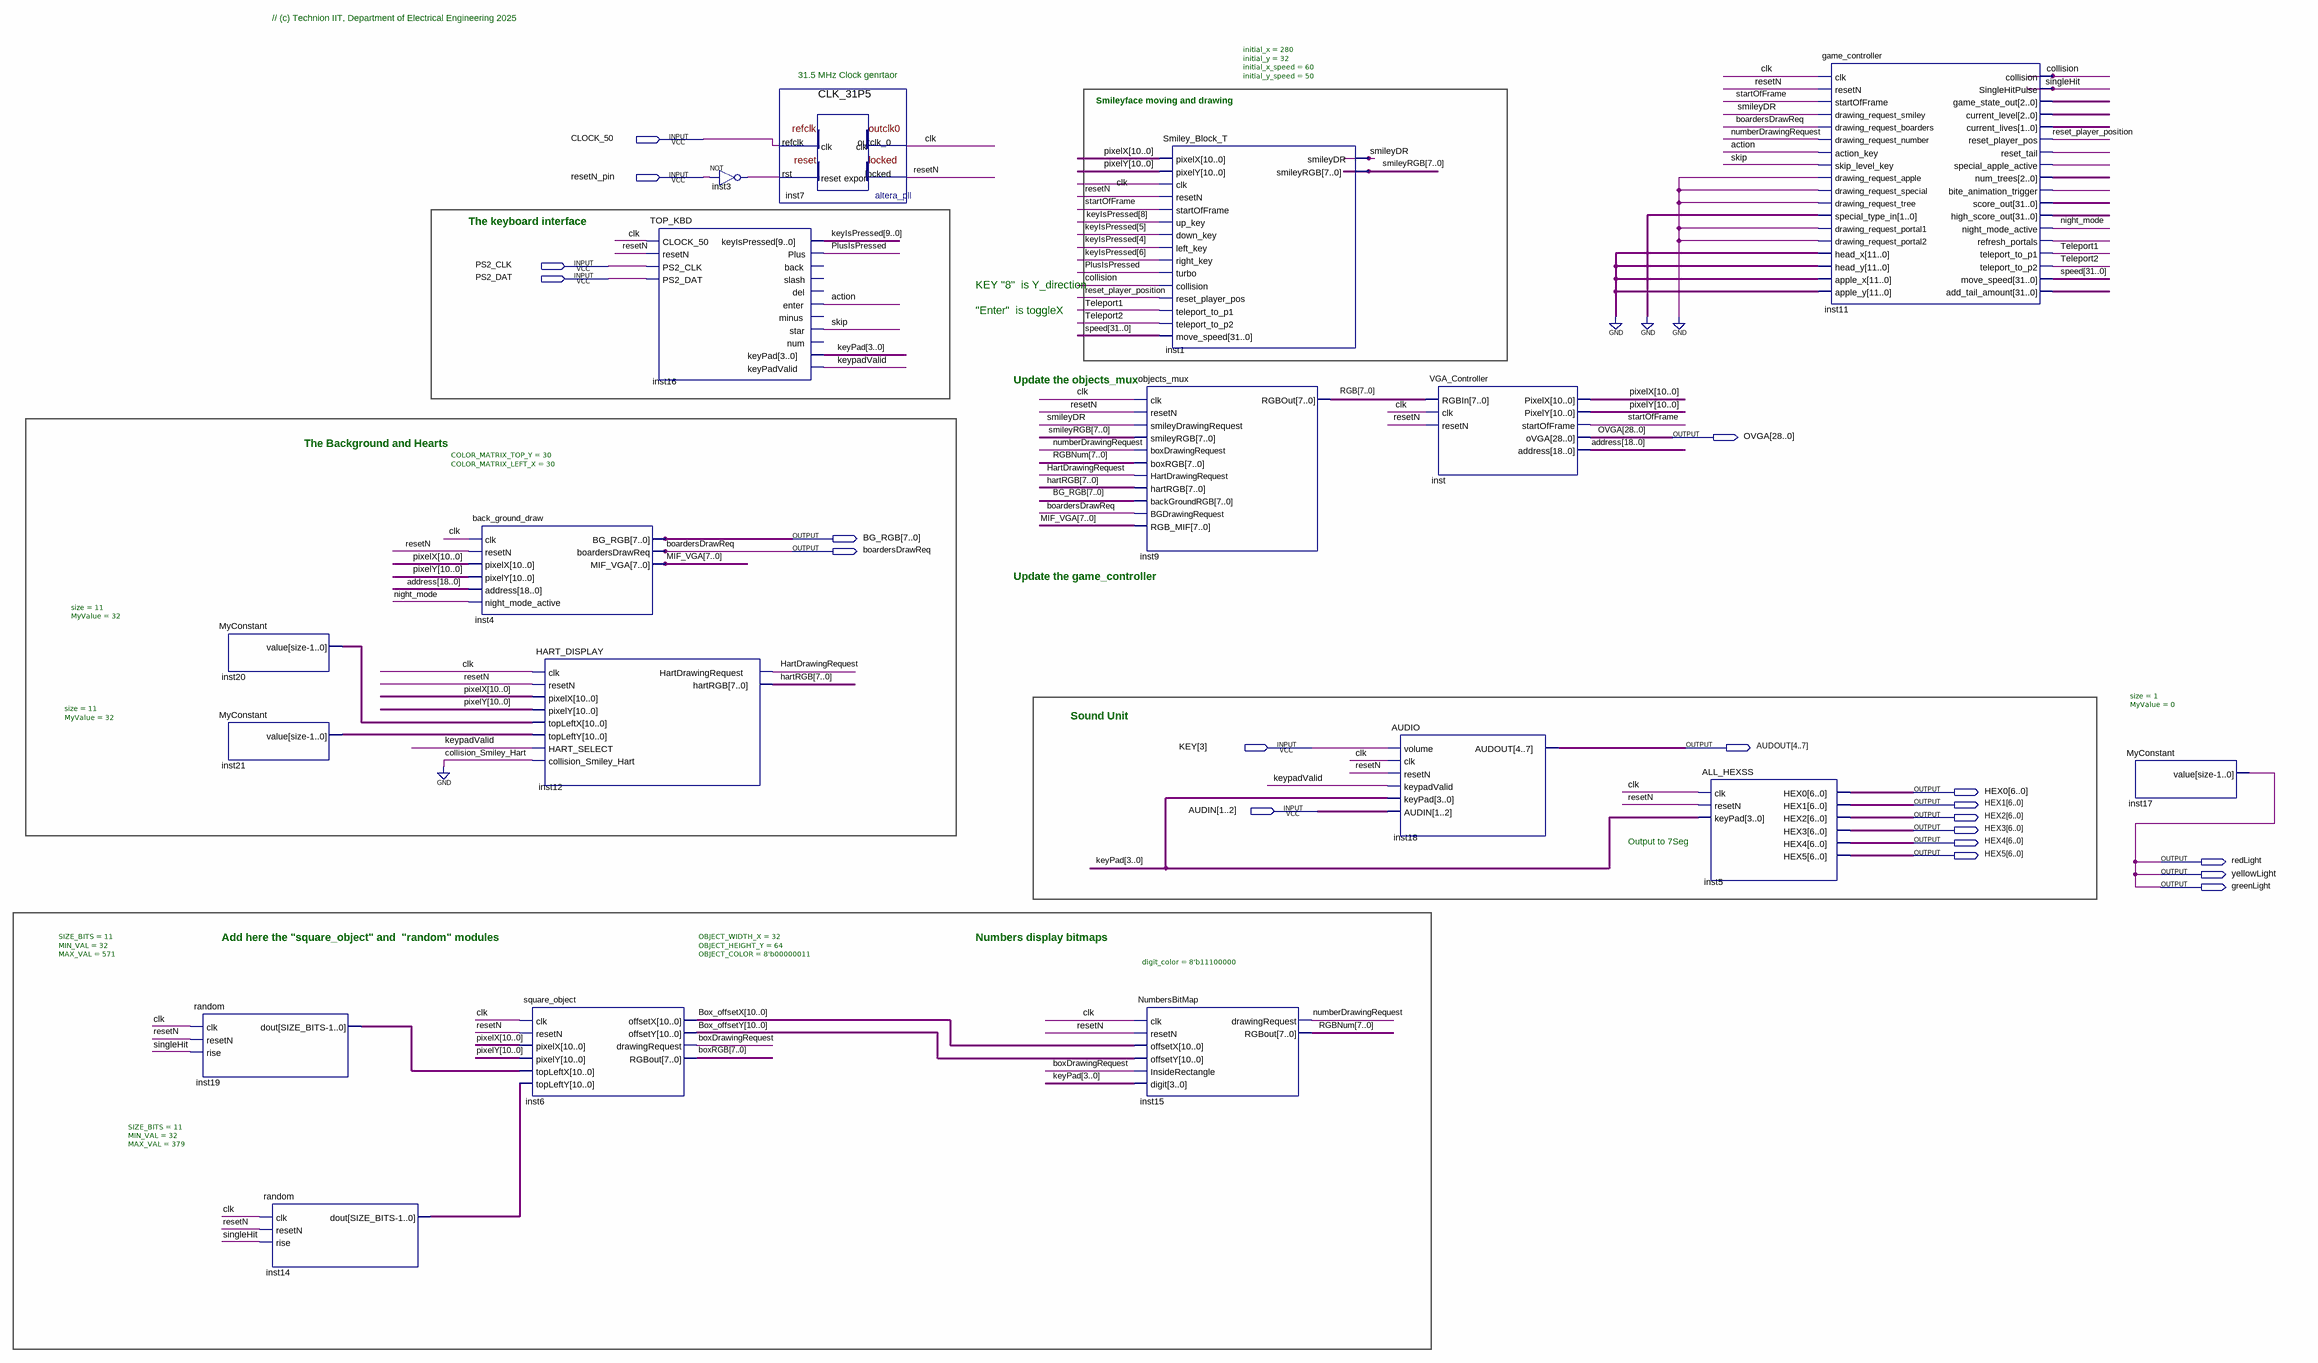
[diagram p0: schematic sheet]
// Quartus schematic TOP_VGA_DEMO.bdf as structural Verilog: 18 symbols, 19 pins
module TOP_VGA_DEMO (
  input  CLOCK_50,
  input  resetN_pin,
  input  PS2_CLK,
  input  PS2_DAT,
  input  [3:3] KEY,
  input  [1:2] AUDIN,
  output [28:0] OVGA,
  output [7:0] BG_RGB,
  output boardersDrawReq,
  output [4:7] AUDOUT,
  output [6:0] HEX0,
  output [6:0] HEX1,
  output [6:0] HEX2,
  output [6:0] HEX3,
  output [6:0] HEX4,
  output [6:0] HEX5,
  output redLight,
  output yellowLight,
  output greenLight
);

  wire action, boxDrawingRequest, clk, collision, HartDrawingRequest, inst3_out,
       inst11_bite_animation_trigger, inst11_refresh_portals, inst11_reset_tail, inst11_special_apple_active,
       keypadValid, night_mode, numberDrawingRequest, PlusIsPressed, reset_player_position, resetN,
       singleHit, skip, smileyDR, startOfFrame, Teleport1, Teleport2;
  wire [1:0] inst11_current_lives;
  wire [2:0] inst11_current_level, inst11_game_state_out, inst11_num_trees;
  wire [3:0] keyPad;
  wire [7:0] boxRGB, hartRGB, MIF_VGA, RGB, RGBNum, smileyRGB;
  wire [9:0] keyIsPressed;
  wire [10:0] Box_offsetX, Box_offsetY, inst14_dout, inst19_dout, inst20_value, inst21_value, pixelX, pixelY;
  wire [18:0] address;
  wire [31:0] inst11_add_tail_amount, inst11_high_score_out, inst11_score_out, speed;

  MyConstant #(.size(11), .MyValue(32)) inst20 (.value(inst20_value));
  MyConstant #(.size(11), .MyValue(32)) inst21 (.value(inst21_value));
  random #(.SIZE_BITS(11), .MIN_VAL(32), .MAX_VAL(571)) inst19 (
    .clk(clk), .resetN(resetN), .rise(singleHit), .dout(inst19_dout));
  random #(.SIZE_BITS(11), .MIN_VAL(32), .MAX_VAL(379)) inst14 (
    .clk(clk), .resetN(resetN), .rise(singleHit), .dout(inst14_dout));
  back_ground_draw #(.COLOR_MATRIX_TOP_Y(30), .COLOR_MATRIX_LEFT_X(30)) inst4 (
    .clk(clk), .resetN(resetN), .pixelX(pixelX), .pixelY(pixelY), .address(address),
    .night_mode_active(night_mode), .BG_RGB(BG_RGB), .boardersDrawReq(boardersDrawReq), .MIF_VGA(MIF_VGA));
  square_object #(.OBJECT_WIDTH_X(32), .OBJECT_HEIGHT_Y(64), .OBJECT_COLOR(8'b00000011)) inst6 (
    .clk(clk), .resetN(resetN), .pixelX(pixelX), .pixelY(pixelY), .topLeftX(inst19_dout),
    .topLeftY(inst14_dout), .offsetX(Box_offsetX), .offsetY(Box_offsetY), .drawingRequest(boxDrawingRequest),
    .RGBout(boxRGB));
  HART_DISPLAY inst12 (
    .clk(clk), .resetN(resetN), .pixelX(pixelX), .pixelY(pixelY), .topLeftX(inst20_value),
    .topLeftY(inst21_value), .HART_SELECT(keypadValid), .collision_Smiley_Hart(1'b0),
    .HartDrawingRequest(HartDrawingRequest), .hartRGB(hartRGB));
  TOP_KBD inst16 (
    .CLOCK_50(clk), .resetN(resetN), .PS2_CLK(PS2_CLK), .PS2_DAT(PS2_DAT), .keyIsPressed(keyIsPressed),
    .Plus(PlusIsPressed), .enter(action), .star(skip), .keyPad(keyPad), .keyPadValid(keypadValid));  // open: back, slash, del, minus, num
  not inst3 (inst3_out, resetN_pin);
  CLK_31P5 inst7 (.refclk(CLOCK_50), .rst(inst3_out), .outclk_0(clk), .locked(resetN));
  Smiley_Block_T #(.initial_x(280), .initial_y(32), .initial_x_speed(60), .initial_y_speed(50)) inst1 (
    .pixelX(pixelX), .pixelY(pixelY), .clk(clk), .resetN(resetN), .startOfFrame(startOfFrame),
    .up_key(keyIsPressed[8]), .down_key(keyIsPressed[5]), .left_key(keyIsPressed[4]),
    .right_key(keyIsPressed[6]), .turbo(PlusIsPressed), .collision(collision),
    .reset_player_pos(reset_player_position), .teleport_to_p1(Teleport1), .teleport_to_p2(Teleport2),
    .move_speed(speed), .smileyDR(smileyDR), .smileyRGB(smileyRGB));
  objects_mux inst9 (
    .clk(clk), .resetN(resetN), .smileyDrawingRequest(smileyDR), .smileyRGB(smileyRGB),
    .boxDrawingRequest(numberDrawingRequest), .boxRGB(RGBNum), .HartDrawingRequest(HartDrawingRequest),
    .hartRGB(hartRGB), .backGroundRGB(BG_RGB), .BGDrawingRequest(boardersDrawReq), .RGB_MIF(MIF_VGA),
    .RGBOut(RGB));
  NumbersBitMap #(.digit_color(8'b11100000)) inst15 (
    .clk(clk), .resetN(resetN), .offsetX(Box_offsetX), .offsetY(Box_offsetY),
    .InsideRectangle(boxDrawingRequest), .digit(keyPad), .drawingRequest(numberDrawingRequest),
    .RGBout(RGBNum));
  VGA_Controller inst (
    .RGBIn(RGB), .clk(clk), .resetN(resetN), .PixelX(pixelX), .PixelY(pixelY), .startOfFrame(startOfFrame),
    .oVGA(OVGA), .address(address));
  AUDIO inst18 (
    .volume(KEY[3]), .clk(clk), .resetN(resetN), .keypadValid(keypadValid), .keyPad(keyPad), .AUDIN(AUDIN),
    .AUDOUT(AUDOUT));
  ALL_HEXSS inst5 (
    .clk(clk), .resetN(resetN), .keyPad(keyPad), .HEX0(HEX0), .HEX1(HEX1), .HEX2(HEX2), .HEX3(HEX3),
    .HEX4(HEX4), .HEX5(HEX5));
  game_controller inst11 (
    .clk(clk), .resetN(resetN), .startOfFrame(startOfFrame), .drawing_request_smiley(smileyDR),
    .drawing_request_boarders(boardersDrawReq), .drawing_request_number(numberDrawingRequest),
    .action_key(action), .skip_level_key(skip), .drawing_request_apple(1'b0), .drawing_request_special(1'b0),
    .drawing_request_tree(1'b0), .special_type_in(2'b00), .drawing_request_portal1(1'b0),
    .drawing_request_portal2(1'b0), .head_x({12{1'b0}}), .head_y({12{1'b0}}), .apple_x({12{1'b0}}),
    .apple_y({12{1'b0}}), .collision(collision), .SingleHitPulse(singleHit),
    .game_state_out(inst11_game_state_out), .current_level(inst11_current_level),
    .current_lives(inst11_current_lives), .reset_player_pos(reset_player_position),
    .reset_tail(inst11_reset_tail), .special_apple_active(inst11_special_apple_active),
    .num_trees(inst11_num_trees), .bite_animation_trigger(inst11_bite_animation_trigger),
    .score_out(inst11_score_out), .high_score_out(inst11_high_score_out), .night_mode_active(night_mode),
    .refresh_portals(inst11_refresh_portals), .teleport_to_p1(Teleport1), .teleport_to_p2(Teleport2),
    .move_speed(speed), .add_tail_amount(inst11_add_tail_amount));
  MyConstant #(.size(1), .MyValue(0)) inst17 (.value(greenLight));

  assign redLight = greenLight;
  assign yellowLight = greenLight;

  // Notes on the sheet:
  //   // (c) Technion IIT, Department of Electrical Engineering 2025
  //   31.5 MHz Clock genrtaor
  //   Smileyface moving and drawing
  //   The keyboard interface
  //   KEY "8"  is Y_direction
  //   "Enter"  is toggleX
  //   Update the objects_mux
  //   The Background and Hearts
  //   Update the game_controller
  //   Sound Unit
  //   Output to 7Seg
  //   Add here the "square_object" and  "random" modules
  //   Numbers display bitmaps
endmodule
